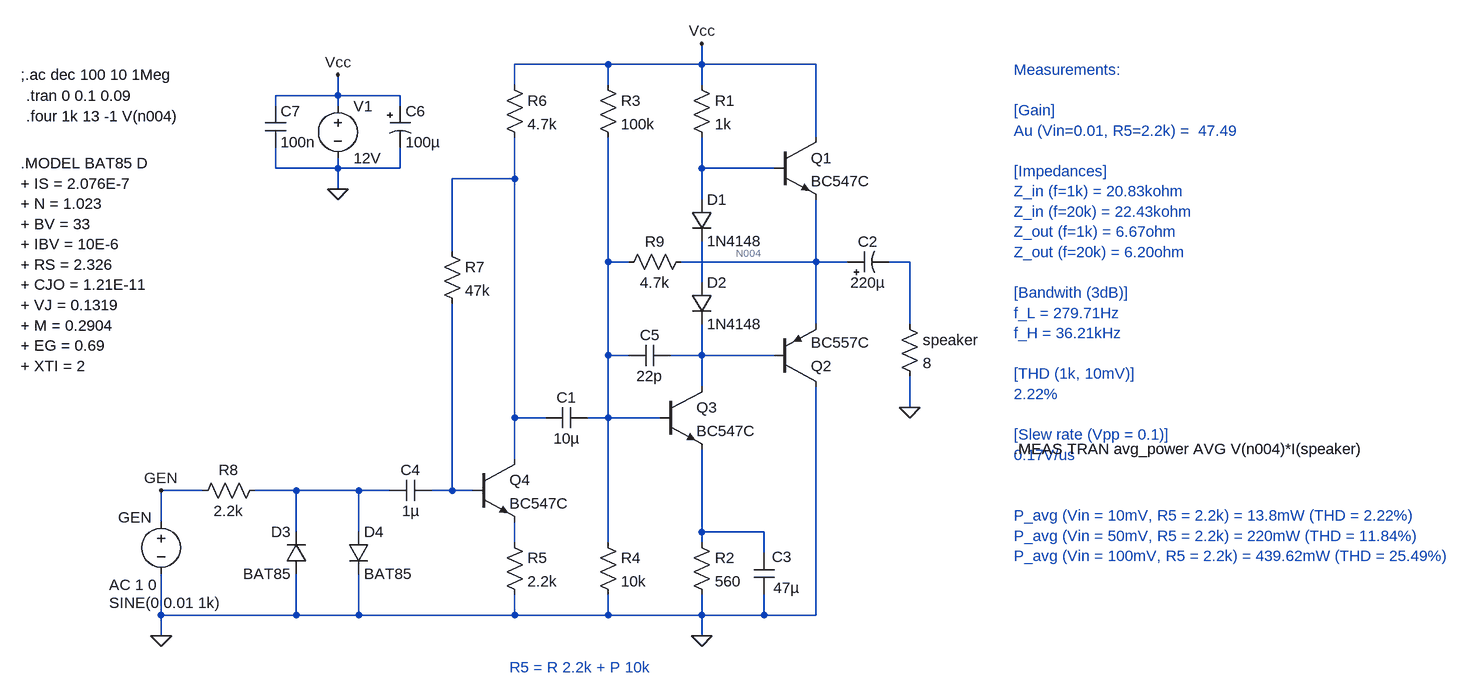
[diagram p0: schematic class-ab-amplifier.asc]
class-ab-amplifier.asc, the LTspice schematic file:
Version 4.1
SHEET 1 1364 1224
WIRE 0 -240 -144 -240
WIRE 144 -240 144 -272
WIRE 144 -240 0 -240
WIRE 320 -240 144 -240
WIRE -144 -208 -144 -240
WIRE 0 -208 0 -240
WIRE 144 -208 144 -240
WIRE -416 -192 -416 -224
WIRE -416 -192 -512 -192
WIRE -320 -192 -416 -192
WIRE -512 -176 -512 -192
WIRE -416 -176 -416 -192
WIRE -320 -176 -320 -192
WIRE 320 -128 320 -240
WIRE -512 -80 -512 -112
WIRE -416 -80 -416 -96
WIRE -416 -80 -512 -80
WIRE -320 -80 -320 -112
WIRE -320 -80 -416 -80
WIRE 144 -80 144 -128
WIRE 256 -80 144 -80
WIRE -144 -64 -144 -128
WIRE -144 -64 -240 -64
WIRE -416 -48 -416 -80
WIRE 144 -32 144 -80
WIRE -240 48 -240 -64
WIRE 0 64 0 -128
WIRE 32 64 0 64
WIRE 320 64 320 -32
WIRE 320 64 112 64
WIRE 368 64 320 64
WIRE 464 64 432 64
WIRE 144 96 144 32
WIRE 320 160 320 64
WIRE 464 160 464 64
WIRE 0 208 0 64
WIRE 32 208 0 208
WIRE 144 208 144 160
WIRE 144 208 96 208
WIRE 256 208 144 208
WIRE 144 256 144 208
WIRE 464 288 464 240
WIRE -144 304 -144 -64
WIRE -96 304 -144 304
WIRE 0 304 0 208
WIRE 0 304 -32 304
WIRE 80 304 0 304
WIRE -144 368 -144 304
WIRE -624 416 -688 416
WIRE -480 416 -544 416
WIRE -384 416 -480 416
WIRE -336 416 -384 416
WIRE -240 416 -240 128
WIRE -240 416 -272 416
WIRE -208 416 -240 416
WIRE -688 464 -688 416
WIRE -480 480 -480 416
WIRE -384 480 -384 416
WIRE 144 480 144 352
WIRE 240 480 144 480
WIRE -144 496 -144 464
WIRE 0 496 0 304
WIRE 144 496 144 480
WIRE 240 512 240 480
WIRE -688 608 -688 544
WIRE -480 608 -480 544
WIRE -480 608 -688 608
WIRE -384 608 -384 544
WIRE -384 608 -480 608
WIRE -144 608 -144 576
WIRE -144 608 -384 608
WIRE 0 608 0 576
WIRE 0 608 -144 608
WIRE 144 608 144 576
WIRE 144 608 0 608
WIRE 240 608 240 576
WIRE 240 608 144 608
WIRE 320 608 320 256
WIRE 320 608 240 608
WIRE -688 640 -688 608
WIRE 144 640 144 608
FLAG 144 640 0
FLAG 144 -272 Vcc
FLAG -416 -224 Vcc
FLAG -416 -48 0
FLAG 464 288 0
FLAG -688 640 0
FLAG -688 416 GEN
SYMBOL npn 256 -128 R0
SYMATTR InstName Q1
SYMATTR Value BC547C
SYMBOL pnp 256 256 M180
SYMATTR InstName Q2
SYMATTR Value BC557C
SYMBOL npn 80 256 R0
SYMATTR InstName Q3
SYMATTR Value BC547C
SYMBOL diode 128 -32 R0
SYMATTR InstName D1
SYMATTR Value 1N4148
SYMBOL diode 128 96 R0
SYMATTR InstName D2
SYMATTR Value 1N4148
SYMBOL res 128 -224 R0
SYMATTR InstName R1
SYMATTR Value 1k
SYMBOL res 128 480 R0
SYMATTR InstName R2
SYMATTR Value 560
SYMBOL voltage -416 -192 R0
WINDOW 123 0 0 Left 0
WINDOW 39 0 0 Left 0
SYMATTR InstName V1
SYMATTR Value 12V
SYMBOL res -16 -224 R0
SYMATTR InstName R3
SYMATTR Value 100k
SYMBOL res -16 480 R0
SYMATTR InstName R4
SYMATTR Value 10k
SYMBOL cap -32 288 R90
WINDOW 0 0 32 VBottom 2
WINDOW 3 32 32 VTop 2
SYMATTR InstName C1
SYMATTR Value 10µ
SYMBOL polcap 368 80 R270
WINDOW 0 32 32 VTop 2
WINDOW 3 0 32 VBottom 2
SYMATTR InstName C2
SYMATTR Value 220µ
SYMBOL res 448 144 R0
SYMATTR InstName speaker
SYMATTR Value 8
SYMBOL voltage -688 448 R0
WINDOW 0 -66 9 Left 2
WINDOW 3 -80 141 Left 2
WINDOW 123 -80 113 Left 2
WINDOW 39 0 0 Left 0
SYMATTR InstName GEN
SYMATTR Value SINE(0 0.01 1k)
SYMATTR Value2 AC 1 0
SYMBOL cap 256 576 R180
WINDOW 0 -27 58 Left 2
WINDOW 3 -39 10 Left 2
SYMATTR InstName C3
SYMATTR Value 47µ
SYMBOL npn -208 368 R0
SYMATTR InstName Q4
SYMATTR Value BC547C
SYMBOL res -160 480 R0
SYMATTR InstName R5
SYMATTR Value 2.2k
SYMBOL res -160 -224 R0
SYMATTR InstName R6
SYMATTR Value 4.7k
SYMBOL res -256 32 R0
SYMATTR InstName R7
SYMATTR Value 47k
SYMBOL cap -272 400 R90
WINDOW 0 0 32 VBottom 2
WINDOW 3 32 32 VTop 2
SYMATTR InstName C4
SYMATTR Value 1µ
SYMBOL cap 96 192 R90
WINDOW 0 0 32 VBottom 2
WINDOW 3 32 32 VTop 2
SYMATTR InstName C5
SYMATTR Value 22p
SYMBOL res -528 400 R90
WINDOW 0 0 56 VBottom 2
WINDOW 3 32 56 VTop 2
SYMATTR InstName R8
SYMATTR Value 2.2k
SYMBOL diode -400 480 R0
SYMATTR InstName D4
SYMATTR Value BAT85
SYMBOL diode -464 544 R180
WINDOW 0 24 64 Left 2
WINDOW 3 24 0 Left 2
SYMATTR InstName D3
SYMATTR Value BAT85
SYMBOL res 128 48 R90
WINDOW 0 0 56 VBottom 2
WINDOW 3 32 56 VTop 2
SYMATTR InstName R9
SYMATTR Value 4.7k
SYMBOL polcap -336 -176 R0
SYMATTR InstName C6
SYMATTR Value 100µ
SYMBOL cap -528 -176 R0
SYMATTR InstName C7
SYMATTR Value 100n
TEXT -896 -192 Left 2 !.tran 0 0.1 0.09
TEXT -152 688 Left 2 ;R5 = R 2.2k + P 10k
TEXT -904 -224 Left 2 !;.ac dec 100 10 1Meg
TEXT -904 -88 Left 2 !.MODEL BAT85 D \n+ IS = 2.076E-7 \n+ N = 1.023 \n+ BV = 33 \n+ IBV = 10E-6 \n+ RS = 2.326 \n+ CJO = 1.21E-11 \n+ VJ = 0.1319 \n+ M = 0.2904 \n+ EG = 0.69 \n+ XTI = 2
TEXT 624 -232 Left 2 ;Measurements:\n \n[Gain]\nAu (Vin=0.01, R5=2.2k) =  47.49\n \n[Impedances]\nZ_in (f=1k) = 20.83kohm\nZ_in (f=20k) = 22.43kohm\nZ_out (f=1k) = 6.67ohm\nZ_out (f=20k) = 6.20ohm\n \n[Bandwith (3dB)]\nf_L = 279.71Hz\nf_H = 36.21kHz\n \n[THD (1k, 10mV)]\n2.22%\n \n[Slew rate (Vpp = 0.1)]\n0.17V/us\n \n \nP_avg (Vin = 10mV, R5 = 2.2k) = 13.8mW (THD = 2.22%)\nP_avg (Vin = 50mV, R5 = 2.2k) = 220mW (THD = 11.84%)\nP_avg (Vin = 100mV, R5 = 2.2k) = 439.62mW (THD = 25.49%)
TEXT -896 -160 Left 2 !.four 1k 13 -1 V(n004)
TEXT 624 352 Left 2 !.MEAS TRAN avg_power AVG V(n004)*I(speaker)

The netlist it stands for:
* class-ab-amplifier.asc
Q1 Vcc N001 N004 0 BC547C
Q2 0 N007 N004 0 BC557C
Q3 N007 N003 N010 0 BC547C
D1 N001 N006 1N4148
D2 N006 N007 1N4148
R1 Vcc N001 1k
R2 N010 0 560
V1 Vcc 0 12V
R3 Vcc N003 100k
R4 N003 0 10k
C1 N003 N002 10µ
C2 N004 N005 220µ
R§speaker N005 0 8
V§GEN GEN 0 SINE(0 0.01 1k) AC 1 0
C3 0 N010 47µ
Q4 N002 N009 N011 0 BC547C
R5 N011 0 2.2k
R6 Vcc N002 4.7k
R7 N002 N009 47k
C4 N009 N008 1µ
C5 N007 N003 22p
R8 N008 GEN 2.2k
D4 N008 0 BAT85
D3 0 N008 BAT85
R9 N004 N003 4.7k
C6 Vcc 0 100µ
C7 Vcc 0 100n
.model D D
.lib standard.dio
.model NPN NPN
.model PNP PNP
.lib standard.bjt
.tran 0 0.1 0.09
* R5 = R 2.2k + P 10k
;.ac dec 100 10 1Meg
.MODEL BAT85 D
+ IS = 2.076E-7
+ N = 1.023
+ BV = 33
+ IBV = 10E-6
+ RS = 2.326
+ CJO = 1.21E-11
+ VJ = 0.1319
+ M = 0.2904
+ EG = 0.69
+ XTI = 2
* Measurements:
* [Gain]
* Au (Vin=0.01, R5=2.2k) =  47.49
* [Impedances]
* Z_in (f=1k) = 20.83kohm
* Z_in (f=20k) = 22.43kohm
* Z_out (f=1k) = 6.67ohm
* Z_out (f=20k) = 6.20ohm
* [Bandwith (3dB)]
* f_L = 279.71Hz
* f_H = 36.21kHz
* [THD (1k, 10mV)]
* 2.22%
* [Slew rate (Vpp = 0.1)]
* 0.17V/us
* P_avg (Vin = 10mV, R5 = 2.2k) = 13.8mW (THD = 2.22%)
* P_avg (Vin = 50mV, R5 = 2.2k) = 220mW (THD = 11.84%)
* P_avg (Vin = 100mV, R5 = 2.2k) = 439.62mW (THD = 25.49%)
.four 1k 13 -1 V(n004)
.MEAS TRAN avg_power AVG V(n004)*I(speaker)
.backanno
.end